# EAGLE design temperature_sensor (EAGLE 7.6.0)
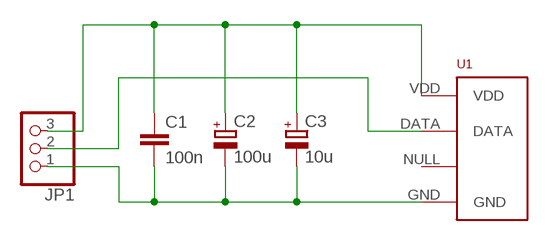
[diagram p0: schematic, sheet 1]

## Parts
C1  100n  C-EU050-024X044  [C050-024X044]
C2  100u  CPOL-EUE2-5  [E2-5]
C3  10u  CPOL-EUE1.8-4  [E1,8-4]
JP1  PINHD-1X3  [1X03]
U1  RHT03_DHT-22_AM2302RA  [RHT03_DHT-22/RA]

## Nets
N$1: C1.2 C2.- C3.- JP1.1 U1.GND
N$2: C1.1 C2.+ C3.+ JP1.3 U1.VDD
N$3: JP1.2 U1.DATA
Unconnected: U1.NULL

## Library data of the parts
C1 = rcl:C-EU: CAPACITOR, European symbol
C2 C3 = rcl:CPOL-EU: POLARIZED CAPACITOR, European symbol
JP1 = pinhead:PINHD-1X3: PIN HEADER
U1 = RHT03_DHT-22_AM2302:RHT03_DHT-22_AM2302: RHT03 / DHT-22 / AM2302 Packages and symbol for the RHT03 / DHT-22 relative humidity and temperature sensor. Note: The AM2302 is a wired version of the DHT-22 which typically requires less clearance and is thus provided as a separate package.; PROD_ID: SEN-10167

## Board
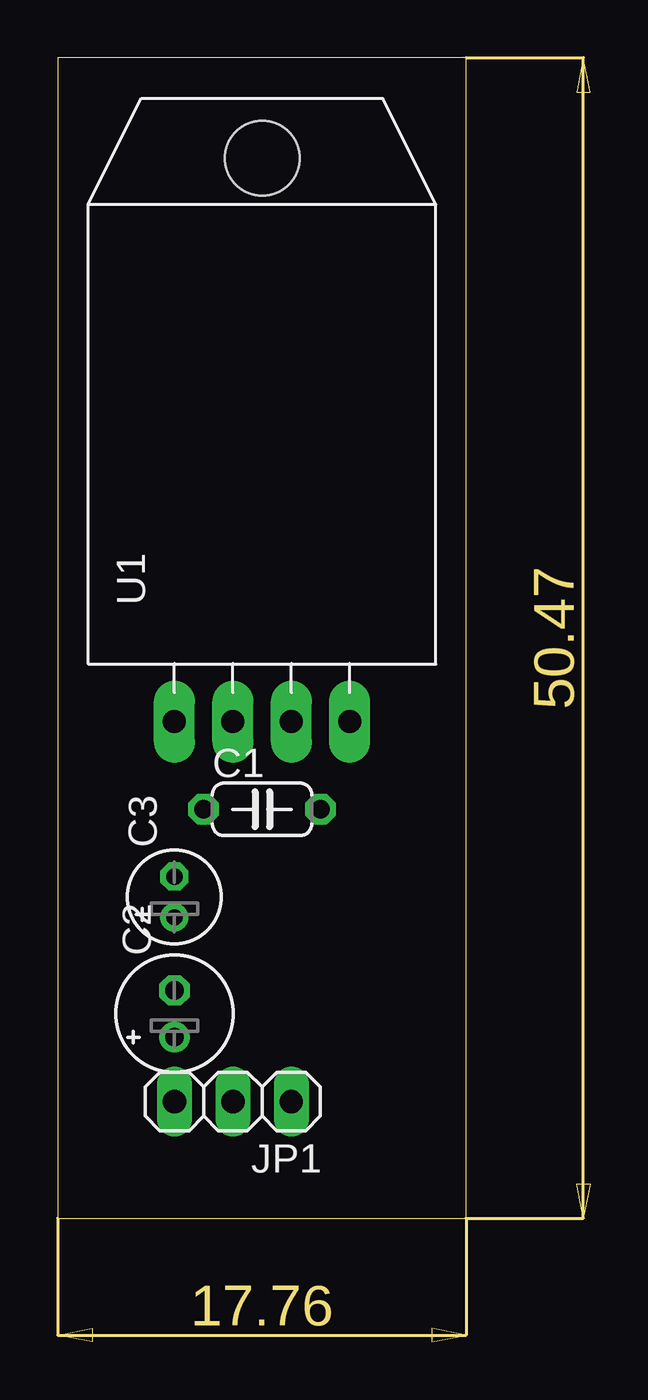
[diagram p1: board, top side]
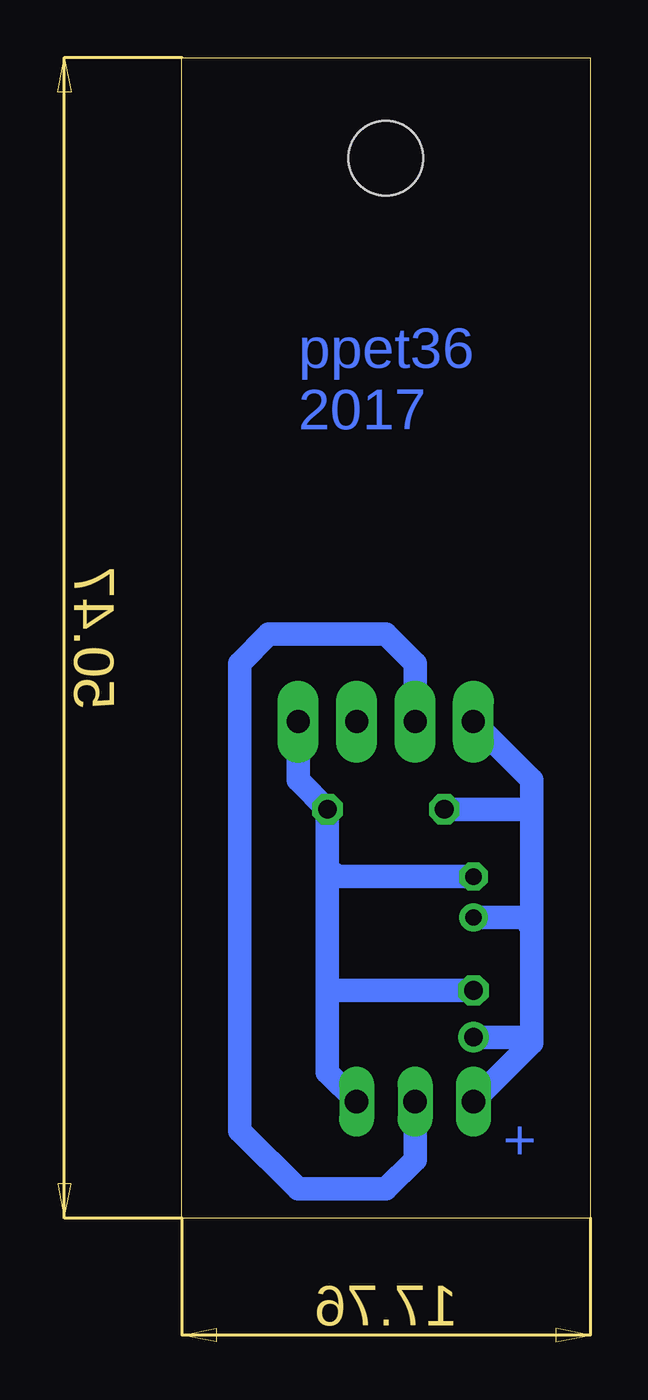
[diagram p2: board, bottom side, seen from below]

Size 17.76 x 50.47 mm. Coordinates in mm from the lower left corner, seen from the top.
Outline: 0,0 17.76,0 17.76,50.47 0,50.47 0,0
Copper layers (1*16): Top 0.035mm / dielectric 1.5mm / Bottom 0.035mm
Design rules "default": minimum track width 10mil, minimum drill 24mil, track to track 8mil, track to pad 8mil, pad to pad 8mil, via to via 8mil, smd to smd 8mil, copper to edge 40mil, drill to drill 8mil, minimum pad ring 10mil, minimum via ring 8mil, stop-mask expansion 4mil, vias tented up to drill 0mil, thermal gap 10mil

### Footprints (pad centres in the part's own frame; a part is rotated, then mirrored left to right if it is on the bottom)
C050-024X044 = drill 0.813 octagon: 1 -2.54,0; 2 2.54,0
E2-5 = drill 0.813 pad 1.27: + -1.016,0 | drill 0.813 pad 1.27 octagon: - 1.016,0
E1,8-4 = drill 0.711 pad 1.168: + -0.889,0 | drill 0.711 pad 1.168 octagon: - 0.889,0
1X03 = drill 1.016 long: 1 -2.54,0; 2 0,0; 3 2.54,0
RHT03_DHT-22/RA = drill 1 pad 1.778 long: DATA -1.27,0; GND 3.81,0; NULL 1.27,0; VDD -3.81,0 | hole 3.25: 0,24.5

### Placement (x,y rotation side)
C1  8.89,17.78 0 top
C2  5.08,8.89 90 top
C3  5.08,13.97 90 top
JP1  7.62,5.08 180 top
U1  8.89,21.59 0 top

### Tracks (layer width: path | path; a pad name or v marks a point on that pad's centre or on a via)
N$1
  Bottom 1.016: JP1.1 11.43,6.35 11.43,10.16 | 11.43,10.16 11.43,15.24 | 11.43,15.24 C1.2 12.7,19.05 U1.GND | C2.- 11.18,9.91 11.43,10.16 | C3.- 11.05,14.86 11.43,15.24
N$2
  Bottom 1.016: JP1.3 2.54,7.62 | C2.+ 2.79,7.87 2.54,7.62 | 2.54,7.62 2.54,12.7 | 2.54,12.7 2.54,17.78 | 2.54,17.78 2.54,19.05 U1.VDD | C1.1 2.54,17.78 | C3.+ 2.92,13.08 2.54,12.7
N$3
  Bottom 1.016: U1.DATA 7.62,24.13 8.89,25.4 13.97,25.4 15.24,24.13 15.24,3.81 12.7,1.27 8.89,1.27 7.62,2.54 JP1.2

### Text on the board
Bottom: ppet36 / 2017 | +